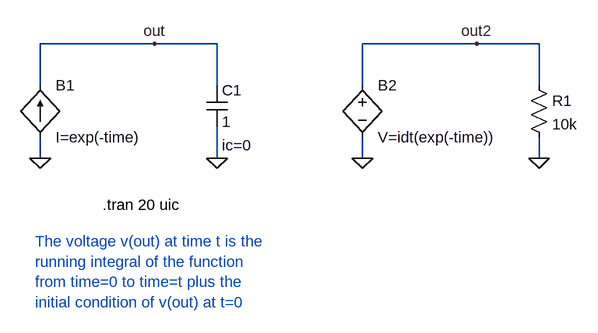
[diagram p0: schematic integrate.asc]
integrate.asc, the LTspice schematic file:
Version 4
SHEET 1 880 680
WIRE 128 96 -48 96
WIRE 224 96 128 96
WIRE 624 96 448 96
WIRE 720 96 624 96
WIRE -48 160 -48 96
WIRE 224 160 224 96
WIRE 448 160 448 96
WIRE 720 160 720 96
WIRE -48 272 -48 240
WIRE 224 272 224 224
WIRE 448 272 448 240
WIRE 720 272 720 240
FLAG 224 272 0
FLAG -48 272 0
FLAG 128 96 out
FLAG 720 272 0
FLAG 448 272 0
FLAG 624 96 out2
SYMBOL cap 208 160 R0
WINDOW 123 24 92 Left 0
SYMATTR InstName C1
SYMATTR Value 1
SYMATTR Value2 ic=0
SYMBOL bi2 -48 160 R0
SYMATTR InstName B1
SYMATTR Value I=exp(-time)
SYMBOL res 704 144 R0
SYMATTR InstName R1
SYMATTR Value 10k
SYMBOL bv 448 144 R0
SYMATTR InstName B2
SYMATTR Value V=idt(exp(-time))
TEXT 48 344 Left 0 !.tran 20 uic
TEXT -56 400 Left 0 ;The voltage v(out) at time t is the \nrunning integral of the function\nfrom time=0 to time=t plus the\ninitial condition of v(out) at t=0

The netlist it stands for:
* integrate.asc
C1 out 0 1 ic=0
B1 0 out I=exp(-time)
R1 out2 0 10k
B2 out2 0 V=idt(exp(-time))
.tran 20 uic
* The voltage v(out) at time t is the
* running integral of the function
* from time=0 to time=t plus the
* initial condition of v(out) at t=0
.backanno
.end